# Altium schematic sheet eps_6.0.SchDoc
size A; SheetNumber: 2
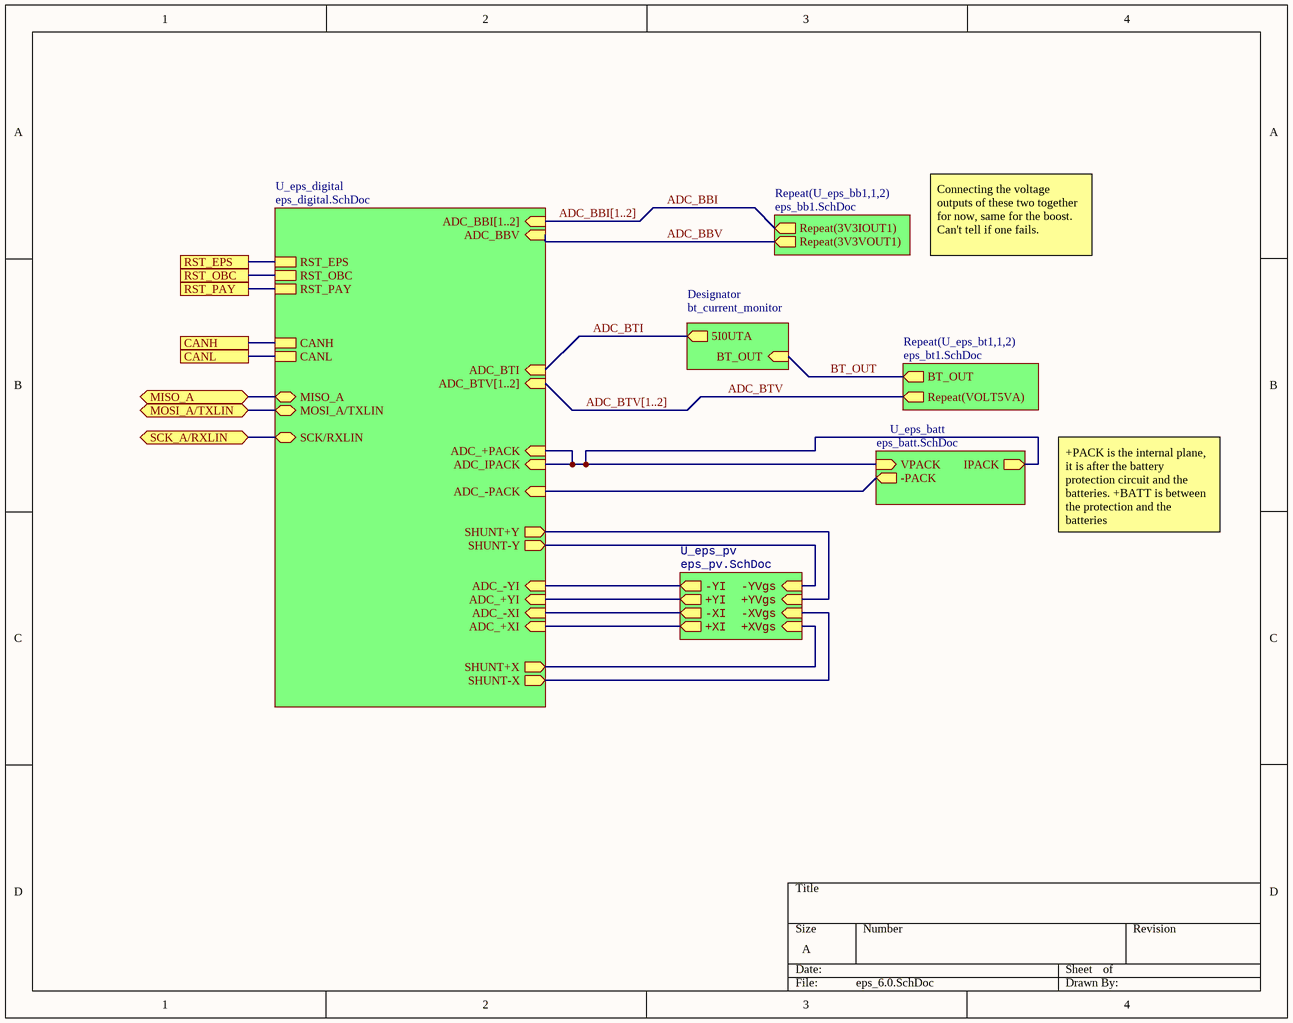
[diagram p0: eps_6.0.SchDoc]

## Sub-sheets
Designator = bt_current_monitor: 5I0UTA (out), BT_OUT (in)
Repeat(U_eps_bb1,1,2) = eps_bb1.SchDoc: Repeat(3V3IOUT1) (out), Repeat(3V3VOUT1) (out)
Repeat(U_eps_bt1,1,2) = eps_bt1.SchDoc: Repeat(VOLT5VA) (out), BT_OUT (out)
U_eps_batt = eps_batt.SchDoc: IPACK (out), VPACK (in), -PACK (out)
U_eps_digital = eps_digital.SchDoc: RST_EPS, RST_OBC, RST_PAY, CANH, CANL, MISO_A (bidir), MOSI_A/TXLIN (bidir), SCK/RXLIN (bidir), ADC_BTV[1..2] (in), ADC_BTI (in), ADC_-PACK (in), ADC_BBI[1..2] (in), ADC_+XI (in), ADC_-XI (in), ADC_+YI (in), ADC_+PACK (in), ADC_-YI (in), SHUNT-Y (out), SHUNT+Y (out), ADC_BBV (in), SHUNT-X (out), SHUNT+X (out), ADC_IPACK (in)
U_eps_pv = eps_pv.SchDoc: +YI (out), -YI (out), -YVgs (in), +XI (out), +YVgs (in), +XVgs (in), -XVgs (in), -XI (out)

## Ports
CANH, CANL, MISO_A (bidir), MOSI_A/TXLIN (bidir), RST_EPS, RST_OBC, RST_PAY, SCK_A/RXLIN (bidir)

## Nets
ADC_BBI: sheet Repeat(U_eps_bb1,1,2)/Repeat(3V3IOUT1)
ADC_BBV: sheet U_eps_digital/ADC_BBV, sheet Repeat(U_eps_bb1,1,2)/Repeat(3V3VOUT1)
ADC_BTI: sheet U_eps_digital/ADC_BTI, sheet Designator/5I0UTA
ADC_BTV: sheet Repeat(U_eps_bt1,1,2)/Repeat(VOLT5VA)
BT_OUT: sheet Repeat(U_eps_bt1,1,2)/BT_OUT, sheet Designator/BT_OUT
CANH: port CANH, sheet U_eps_digital/CANH
CANL: port CANL, sheet U_eps_digital/CANL
MISO_A: port MISO_A, sheet U_eps_digital/MISO_A
MOSI_A/TXLIN: port MOSI_A/TXLIN, sheet U_eps_digital/MOSI_A/TXLIN
RST_EPS: port RST_EPS, sheet U_eps_digital/RST_EPS
RST_OBC: port RST_OBC, sheet U_eps_digital/RST_OBC
RST_PAY: port RST_PAY, sheet U_eps_digital/RST_PAY
SCK_A/RXLIN: port SCK_A/RXLIN, sheet U_eps_digital/SCK/RXLIN
(unnamed): sheet U_eps_digital/ADC_-PACK, sheet U_eps_batt/-PACK
(unnamed): sheet U_eps_digital/ADC_+XI, sheet U_eps_pv/+XI
(unnamed): sheet U_eps_digital/ADC_-XI, sheet U_eps_pv/-XI
(unnamed): sheet U_eps_digital/ADC_+YI, sheet U_eps_pv/+YI
(unnamed): sheet U_eps_digital/ADC_+PACK, sheet U_eps_digital/ADC_IPACK, sheet U_eps_batt/IPACK, sheet U_eps_batt/VPACK
(unnamed): sheet U_eps_digital/ADC_-YI, sheet U_eps_pv/-YI
(unnamed): sheet U_eps_digital/SHUNT-Y, sheet U_eps_pv/-YVgs
(unnamed): sheet U_eps_digital/SHUNT+Y, sheet U_eps_pv/+YVgs
(unnamed): sheet U_eps_digital/SHUNT-X, sheet U_eps_pv/-XVgs
(unnamed): sheet U_eps_digital/SHUNT+X, sheet U_eps_pv/+XVgs

## Buses and harness runs
bus ADC_BBI[1..2] = sheet U_eps_digital/ADC_BBI[1..2]
bus ADC_BTV[1..2] = sheet U_eps_digital/ADC_BTV[1..2]

## Notes on the sheet
- Connecting the voltage outputs of these two together for now, same for the boost. Can't tell if one fails.
- +PACK is the internal plane, it is after the battery protection circuit and the batteries. +BATT is between the protection and the batteries